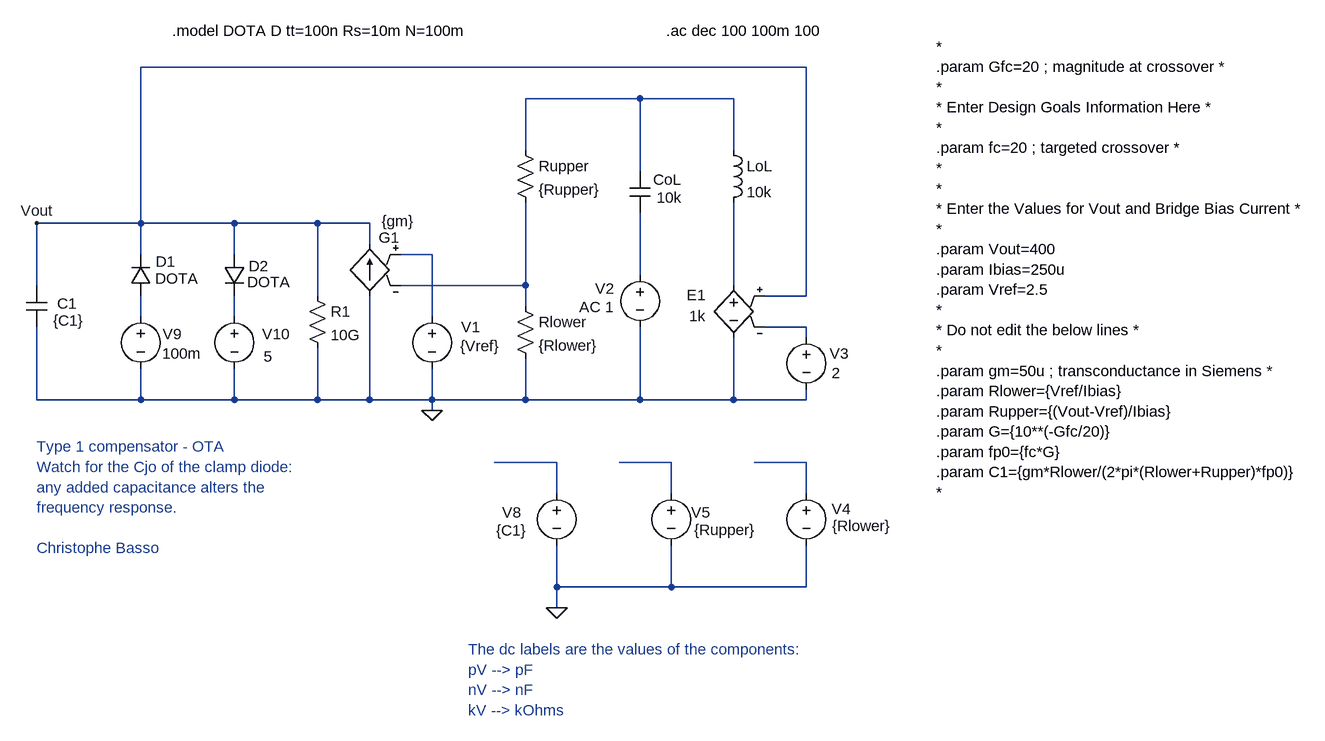
[diagram p0: schematic type 1 - OTA.asc]
type 1 - OTA.asc, the LTspice schematic file:
Version 4
SHEET 1 1976 1096
WIRE 816 -128 -208 -128
WIRE 560 -80 384 -80
WIRE 704 -80 560 -80
WIRE 384 0 384 -80
WIRE 704 0 704 -80
WIRE 560 32 560 -80
WIRE -208 112 -208 -128
WIRE -208 112 -368 112
WIRE -64 112 -208 112
WIRE 64 112 -64 112
WIRE 144 112 64 112
WIRE 144 144 144 112
WIRE -208 160 -208 112
WIRE -64 160 -64 112
WIRE 240 160 192 160
WIRE 560 192 560 96
WIRE -368 208 -368 112
WIRE 384 208 384 80
WIRE 384 208 192 208
WIRE 704 208 704 80
WIRE 64 224 64 112
WIRE 816 224 816 -128
WIRE 816 224 752 224
WIRE 384 240 384 208
WIRE -208 256 -208 224
WIRE -64 256 -64 224
WIRE 240 256 240 160
WIRE 816 272 752 272
WIRE 816 288 816 272
WIRE -368 384 -368 272
WIRE -208 384 -208 336
WIRE -208 384 -368 384
WIRE -64 384 -64 336
WIRE -64 384 -208 384
WIRE 64 384 64 304
WIRE 64 384 -64 384
WIRE 144 384 144 224
WIRE 144 384 64 384
WIRE 240 384 240 336
WIRE 240 384 144 384
WIRE 384 384 384 320
WIRE 384 384 240 384
WIRE 560 384 560 272
WIRE 560 384 384 384
WIRE 704 384 704 288
WIRE 704 384 560 384
WIRE 816 384 816 368
WIRE 816 384 704 384
WIRE 240 400 240 384
WIRE 432 480 336 480
WIRE 608 480 528 480
WIRE 816 480 736 480
WIRE 432 528 432 480
WIRE 608 528 608 480
WIRE 816 528 816 480
WIRE 432 672 432 608
WIRE 608 672 608 608
WIRE 608 672 432 672
WIRE 816 672 816 608
WIRE 816 672 608 672
WIRE 432 704 432 672
FLAG 240 400 0
FLAG -368 112 Vout
FLAG 432 704 0
DATAFLAG 624 -80 ""
DATAFLAG 112 -128 ""
DATAFLAG 320 208 ""
DATAFLAG 352 480 ""
DATAFLAG 544 480 ""
DATAFLAG 768 480 ""
SYMBOL res 368 224 R0
SYMATTR InstName Rlower
SYMATTR Value {Rlower}
SYMBOL res 368 -16 R0
SYMATTR InstName Rupper
SYMATTR Value {Rupper}
SYMBOL voltage 240 240 R0
WINDOW 0 45 32 Left 2
WINDOW 3 43 61 Left 2
WINDOW 123 0 0 Left 0
WINDOW 39 0 0 Left 0
SYMATTR InstName V1
SYMATTR Value {Vref}
SYMBOL cap 544 32 R0
WINDOW 0 36 13 Left 2
WINDOW 3 42 41 Left 2
SYMATTR InstName CoL
SYMATTR Value 10k
SYMBOL voltage 560 176 M0
WINDOW 0 40 37 Left 2
WINDOW 123 40 65 Left 2
WINDOW 39 0 0 Left 0
SYMATTR InstName V2
SYMATTR Value2 AC 1
SYMATTR Value ""
SYMBOL ind 688 -16 R0
SYMATTR InstName LoL
SYMATTR Value 10k
SYMBOL e 704 192 M0
WINDOW 0 43 31 Left 2
WINDOW 3 43 63 Left 2
SYMATTR InstName E1
SYMATTR Value 1k
SYMBOL voltage 816 272 R0
WINDOW 0 36 41 Left 2
WINDOW 3 39 71 Left 2
SYMATTR InstName V3
SYMATTR Value 2
SYMBOL cap -384 272 M180
WINDOW 0 47 36 Left 2
WINDOW 3 41 10 Left 2
SYMATTR InstName C1
SYMATTR Value {C1}
SYMBOL voltage 816 512 R0
WINDOW 0 39 40 Left 2
WINDOW 3 40 66 Left 2
WINDOW 123 0 0 Left 0
WINDOW 39 0 0 Left 0
SYMATTR InstName V4
SYMATTR Value {Rlower}
SYMBOL voltage 608 512 R0
WINDOW 0 31 45 Left 2
WINDOW 3 35 72 Left 2
WINDOW 123 0 0 Left 0
WINDOW 39 0 0 Left 0
SYMATTR InstName V5
SYMATTR Value {Rupper}
SYMBOL voltage 432 512 R0
WINDOW 0 -84 45 Left 2
WINDOW 3 -93 73 Left 2
WINDOW 123 0 0 Left 0
WINDOW 39 0 0 Left 0
SYMATTR InstName V8
SYMATTR Value {C1}
SYMBOL g 144 128 M0
WINDOW 0 -46 6 Left 2
WINDOW 3 -69 -19 Left 2
SYMATTR InstName G1
SYMATTR Value {gm}
SYMBOL diode -192 224 R180
WINDOW 0 -38 53 Left 2
WINDOW 3 -73 27 Left 2
SYMATTR InstName D1
SYMATTR Value DOTA
SYMBOL diode -80 160 R0
WINDOW 0 38 18 Left 2
WINDOW 3 36 43 Left 2
SYMATTR InstName D2
SYMATTR Value DOTA
SYMBOL voltage -208 240 R0
WINDOW 0 34 43 Left 2
WINDOW 3 33 73 Left 2
WINDOW 123 0 0 Left 0
WINDOW 39 0 0 Left 0
SYMATTR InstName V9
SYMATTR Value 100m
SYMBOL voltage -64 240 R0
WINDOW 0 43 43 Left 2
WINDOW 3 45 77 Left 2
SYMATTR InstName V10
SYMATTR Value 5
SYMBOL res 48 208 R0
SYMATTR InstName R1
SYMATTR Value 10G
TEXT 1016 -160 Left 2 !*\n.param Gfc=20 ; magnitude at crossover *\n*\n* Enter Design Goals Information Here *\n*\n.param fc=20 ; targeted crossover *\n*\n*\n* Enter the Values for Vout and Bridge Bias Current *\n*\n.param Vout=400\n.param Ibias=250u\n.param Vref=2.5\n*\n* Do not edit the below lines *\n*\n.param gm=50u ; transconductance in Siemens *\n.param Rlower={Vref/Ibias}\n.param Rupper={(Vout-Vref)/Ibias}\n.param G={10**(-Gfc/20)}\n.param fp0={fc*G}\n.param C1={gm*Rlower/(2*pi*(Rlower+Rupper)*fp0)}\n*
TEXT 600 -184 Left 2 !.ac dec 100 100m 100
TEXT 296 768 Left 2 ;The dc labels are the values of the components:\npV --> pF\nnV --> nF\nkV --> kOhms
TEXT -160 -184 Left 2 !.model DOTA D tt=100n Rs=10m N=100m
TEXT -368 456 Left 2 ;Type 1 compensator - OTA\nWatch for the Cjo of the clamp diode:\nany added capacitance alters the\nfrequency response. \n \nChristophe Basso

The netlist it stands for:
* type 1 - OTA.asc
Rlower N004 0 {Rlower}
Rupper N001 N004 {Rupper}
V1 N002 0 {Vref}
CoL N001 N003 10k
V2 N003 0 AC 1
LoL N001 N005 10k
E1 N005 0 Vout N008 1k
V3 N008 0 2
C1 0 Vout {C1}
V4 N011 0 {Rlower}
V5 N010 0 {Rupper}
V8 N009 0 {C1}
G1 0 Vout N002 N004 {gm}
D1 N006 Vout DOTA
D2 Vout N007 DOTA
V9 N006 0 100m
V10 N007 0 5
R1 Vout 0 10G
.model D D
.lib standard.dio
*
.param Gfc=20 ; magnitude at crossover *
*
* Enter Design Goals Information Here *
*
.param fc=20 ; targeted crossover *
*
*
* Enter the Values for Vout and Bridge Bias Current *
*
.param Vout=400
.param Ibias=250u
.param Vref=2.5
*
* Do not edit the below lines *
*
.param gm=50u ; transconductance in Siemens *
.param Rlower={Vref/Ibias}
.param Rupper={(Vout-Vref)/Ibias}
.param G={10**(-Gfc/20)}
.param fp0={fc*G}
.param C1={gm*Rlower/(2*pi*(Rlower+Rupper)*fp0)}
*
.ac dec 100 100m 100
* The dc labels are the values of the components:
* pV --> pF
* nV --> nF
* kV --> kOhms
.model DOTA D tt=100n Rs=10m N=100m
* Type 1 compensator - OTA
* Watch for the Cjo of the clamp diode:
* any added capacitance alters the
* frequency response.
* Christophe Basso
.backanno
.end